# Altium schematic sheet keyboard_controller.SchDoc
size A4
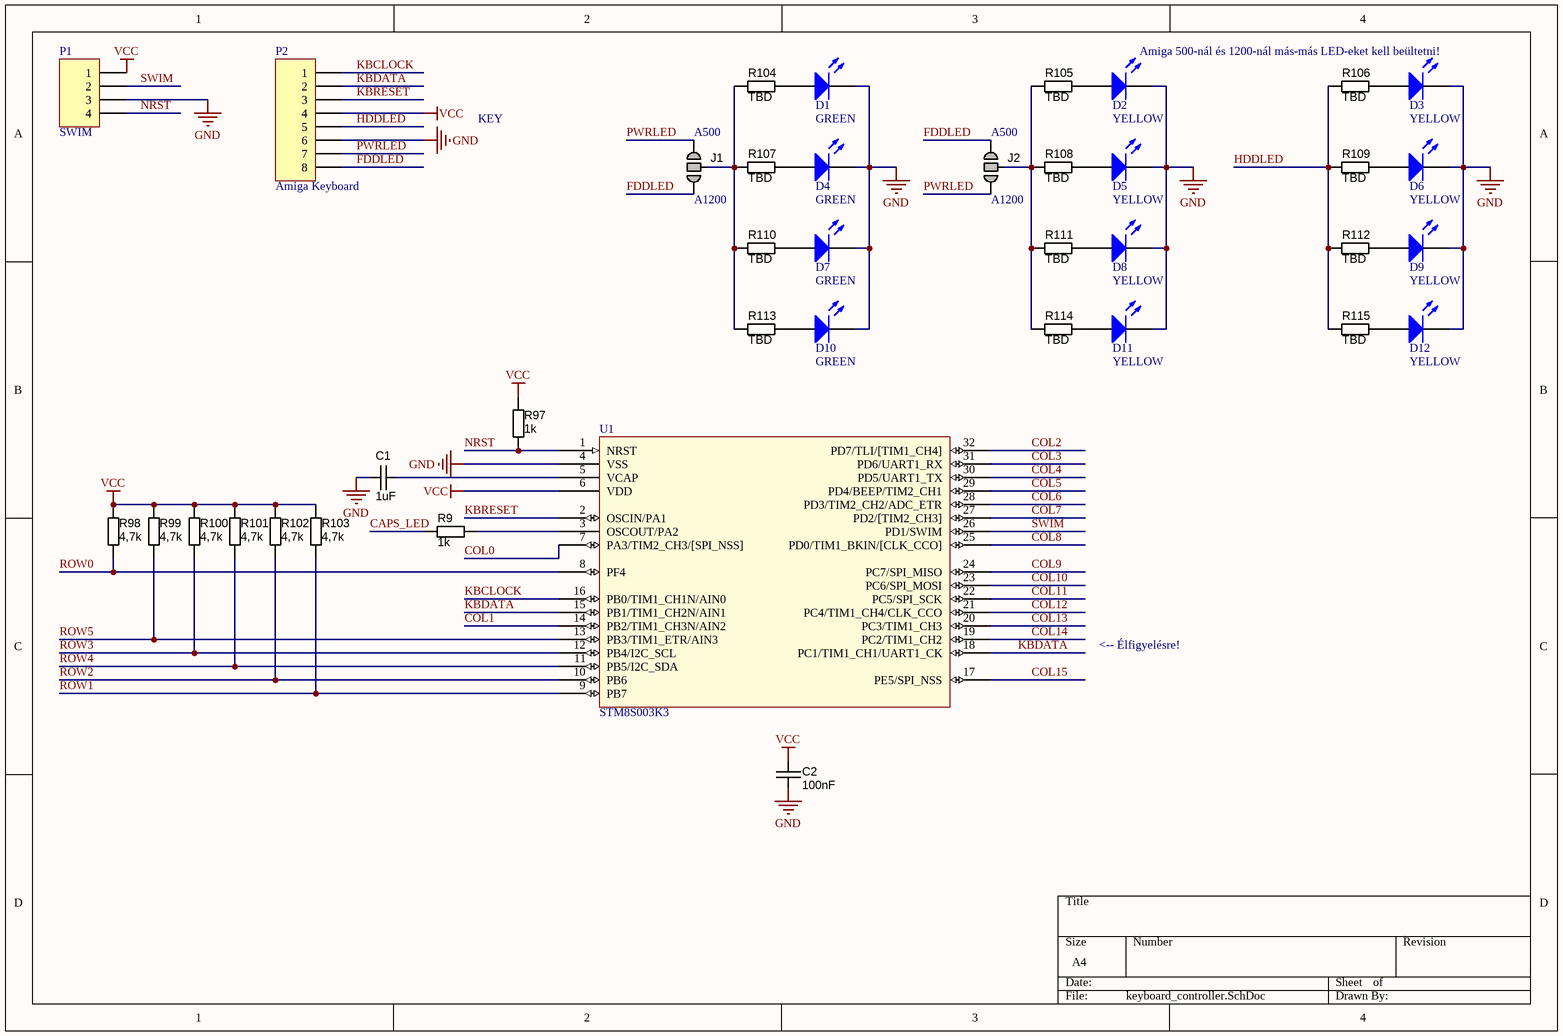
[diagram p0: keyboard_controller.SchDoc]

## Parts
C1  value 1uF  [CAPC2012X135N]  (hidden comment: 0805)
C2  value 100nF  [CAPC2012X135N]  (hidden comment: 0805)
D1  GREEN  [LEDSQ_5mm]
D2  YELLOW  [LEDSQ_5mm]
D3  YELLOW  [LEDSQ_5mm]
D4  GREEN  [LEDSQ_5mm]
D5  YELLOW  [LEDSQ_5mm]
D6  YELLOW  [LEDSQ_5mm]
D7  GREEN  [LEDSQ_5mm]
D8  YELLOW  [LEDSQ_5mm]
D9  YELLOW  [LEDSQ_5mm]
D10  GREEN  [LEDSQ_5mm]
D11  YELLOW  [LEDSQ_5mm]
D12  YELLOW  [LEDSQ_5mm]
J1  Jumper  [Jump_3Way]  (value not drawn)  (no BOM)
J2  Jumper  [Jump_3Way]  (value not drawn)  (no BOM)
P1  SWIM  [HDR1X4]
P2  Amiga Keyboard  [HDR1X8]
R9  value 1k  [RESC2012N_ZERO]  (hidden comment: 0805)
R97  value 1k  [RESC2012N_ZERO]  (hidden comment: 0805)
R98  value 4,7k  [RESC2012N_ZERO]  (hidden comment: 0805)
R99  value 4,7k  [RESC2012N_ZERO]  (hidden comment: 0805)
R100  value 4,7k  [RESC2012N_ZERO]  (hidden comment: 0805)
R101  value 4,7k  [RESC2012N_ZERO]  (hidden comment: 0805)
R102  value 4,7k  [RESC2012N_ZERO]  (hidden comment: 0805)
R103  value 4,7k  [RESC2012N_ZERO]  (hidden comment: 0805)
R104  value TBD  [RESC2012N_ZERO]  (hidden comment: 0805)
R105  value TBD  [RESC2012N_ZERO]  (hidden comment: 0805)
R106  value TBD  [RESC2012N_ZERO]  (hidden comment: 0805)
R107  value TBD  [RESC2012N_ZERO]  (hidden comment: 0805)
R108  value TBD  [RESC2012N_ZERO]  (hidden comment: 0805)
R109  value TBD  [RESC2012N_ZERO]  (hidden comment: 0805)
R110  value TBD  [RESC2012N_ZERO]  (hidden comment: 0805)
R111  value TBD  [RESC2012N_ZERO]  (hidden comment: 0805)
R112  value TBD  [RESC2012N_ZERO]  (hidden comment: 0805)
R113  value TBD  [RESC2012N_ZERO]  (hidden comment: 0805)
R114  value TBD  [RESC2012N_ZERO]  (hidden comment: 0805)
R115  value TBD  [RESC2012N_ZERO]  (hidden comment: 0805)
U1  STM8S003K3  [LQFP32_M]

## Nets
GND: C1.2 C2.2 D1.2(K) D2.2(K) D3.2(K) D4.2(K) D5.2(K) D6.2(K) D7.2(K) D8.2(K) D9.2(K) D10.2(K) D11.2(K) D12.2(K) P1.3 P2.6 U1.4(VSS)
VCC: C2.1 P1.1 P2.4 R97.2 R98.2 R99.2 R100.2 R101.2 R102.2 R103.2 U1.6(VDD)
CAPS_LED: R9.1
COL0: U1.7(PA3/TIM2_CH3/[SPI_NSS])
COL1: U1.14(PB2/TIM1_CH3N/AIN2)
COL2: U1.32(PD7/TLI/[TIM1_CH4])
COL3: U1.31(PD6/UART1_RX)
COL4: U1.30(PD5/UART1_TX)
COL5: U1.29(PD4/BEEP/TIM2_CH1)
COL6: U1.28(PD3/TIM2_CH2/ADC_ETR)
COL7: U1.27(PD2/[TIM2_CH3])
COL8: U1.25(PD0/TIM1_BKIN/[CLK_CCO])
COL9: U1.24(PC7/SPI_MISO)
COL10: U1.23(PC6/SPI_MOSI)
COL11: U1.22(PC5/SPI_SCK)
COL12: U1.21(PC4/TIM1_CH4/CLK_CCO)
COL13: U1.20(PC3/TIM1_CH3)
COL14: U1.19(PC2/TIM1_CH2)
COL15: U1.17(PE5/SPI_NSS)
FDDLED: J1.1 J2.3 P2.8
HDDLED: P2.5 R106.1 R109.1 R112.1 R115.1
KBCLOCK: P2.1 U1.16(PB0/TIM1_CH1N/AIN0)
KBDATA: P2.2 U1.15(PB1/TIM1_CH2N/AIN1) U1.18(PC1/TIM1_CH1/UART1_CK)
KBRESET: P2.3 U1.2(OSCIN/PA1)
NRST: P1.4 R97.1 U1.1(NRST)
PWRLED: J1.3 J2.1 P2.7
ROW0: R98.1 U1.8(PF4)
ROW1: R103.1 U1.9(PB7)
ROW2: R102.1 U1.10(PB6)
ROW3: R100.1 U1.12(PB4/I2C_SCL)
ROW4: R101.1 U1.11(PB5/I2C_SDA)
ROW5: R99.1 U1.13(PB3/TIM1_ETR/AIN3)
SWIM: P1.2 U1.26(PD1/SWIM)
NetC1_1: C1.1 U1.5(VCAP)
NetD1_1: D1.1(A) R104.2
NetD2_1: D2.1(A) R105.2
NetD3_1: D3.1(A) R106.2
NetD4_1: D4.1(A) R107.2
NetD5_1: D5.1(A) R108.2
NetD6_1: D6.1(A) R109.2
NetD7_1: D7.1(A) R110.2
NetD8_1: D8.1(A) R111.2
NetD9_1: D9.1(A) R112.2
NetD10_1: D10.1(A) R113.2
NetD11_1: D11.1(A) R114.2
NetD12_1: D12.1(A) R115.2
NetJ1_2: J1.2 R104.1 R107.1 R110.1 R113.1
NetJ2_2: J2.2 R105.1 R108.1 R111.1 R114.1
NetR9_2: R9.2 U1.3(OSCOUT/PA2)

## Notes on the sheet
- Amiga 500-nál és 1200-nál más-más LED-eket kell beültetni!
- KEY
- (near J1) A500
- (near J2) A500
- (near J1) A1200
- (near J2) A1200
- <-- Élfigyelésre!

## Library data of the parts
C1 C2 = CAPC_1u_0805_X7R_16V_10%: Capacitor SMD Cer X7R 0805; Tolerance: ±10%; Ratings: 16V; X7R; Material: ceramic; SCDType: spec; Package / Case: 0805 (2012 metric); Temperature Coefficient: X7R
D1-D12 = LED: Typical LED; Published: 8-Jun-2000; LatestRevisionDate: 08-Jul-2005; LatestRevisionNote: Mech Layer 1 removed.; PackageReference: LED-1; Publisher: Altium Limited; PackageDescription: LED; 2 Leads
J1 J2 = JUMP_3WAY: SMD jumper
P1 = Header 4: Header, 4-Pin; LatestRevisionDate: 17-Jul-2002; LatestRevisionNote: Re-released for DXP Platform.; Publisher: Altium Limited
P2 = Header 8: Header, 8-Pin; LatestRevisionDate: 17-Jul-2002; LatestRevisionNote: Re-released for DXP Platform.; Publisher: Altium Limited
R9 R97-R115 = RES_0R_0805: Resistor SMD chip 0.0 Ohm 0.125W 0805; Manufacturer 1: Samsung Electro-Mechanics America, Inc; Manufacturer Part Number 1: RC2012J000CS; Ratings: 1/8W; SCDType: spec; Tolerance: N/A; Package / Case: 0805 (2012 metric); Supplier 1: Digi-Key; Supplier Part Number 1: 1276-5466-6-ND; RoHS 1: RoHS Compliant; ComponentLink1URL: http://www.samsungsem.com/servlet/FileDownload?filename=productcatalog/pdf/Chip_Resistor.pdf; ComponentLink1Description: http://www.samsungsem.com/servlet/FileDownload?filename=productcatalog/pdf/Chip_Resistor.pdf; Supplier 2: Digi-Key; Supplier Part Number 2: RMCF0805ZT0R00DKR-ND; Manufacturer 2: Stackpole Electronics Inc; Manufacturer Part Number 2: RMCF0805ZT0R00; RoHS 2: RoHS Compliant; ComponentLink2URL: http://www.seielect.com/Catalog/SEI-RMCF_RMCP.pdf; ComponentLink2Description: http://www.seielect.com/Catalog/SEI-RMCF_RMCP.pdf; Supplier 3: Digi-Key; Supplier Part Number 3: 311-0.0ARDKR-ND; Manufacturer 3: Yageo; Manufacturer Part Number 3: RC0805JR-070RL; RoHS 3: RoHS Compliant; ComponentLink3URL: http://media.digikey.com/pdf/Data%20Sheets/Yageo%20PDFs/RC0805%20Pb%20Free.pdf; ComponentLink3Description: http://media.digikey.com/pdf/Data%20Sheets/Yageo%20PDFs/RC0805%20Pb%20Free.pdf; Supplier 4: Digi-Key; Supplier Part Number 4: P0.0ADKR-ND; Manufacturer 4: Panasonic Electronic Components; Manufacturer Part Number 4: ERJ-6GEY0R00V; RoHS 4: RoHS Compliant; ComponentLink4URL: http://industrial.panasonic.com/www-cgi/jvcr13pz.cgi?E+PZ+3+AOA0001+ERJ6GEY0R00V+7+WW; ComponentLink4Description: http://industrial.panasonic.com/www-cgi/jvcr13pz.cgi?E+PZ+3+AOA0001+ERJ6GEY0R00V+7+WW; Supplier 5: Digi-Key; Supplier Part Number 5: RHM0.0CPDKR-ND; Manufacturer 5: Rohm Semiconductor; Manufacturer Part Number 5: MCR10ERTJ000; RoHS 5: RoHS Compliant; ComponentLink5URL: http://rohmfs.rohm.com/en/products/databook/datasheet/passive/resistor/chip_resistor/mcr_g.pdf; ComponentLink5Description: http://rohmfs.rohm.com/en/products/databook/datasheet/passive/resistor/chip_resistor/mcr_g.pdf
U1 = STM8S003K3: ST Microelectronics STM8S003K3 microcontroller